# Altium project wlpkt1.PrjPcb
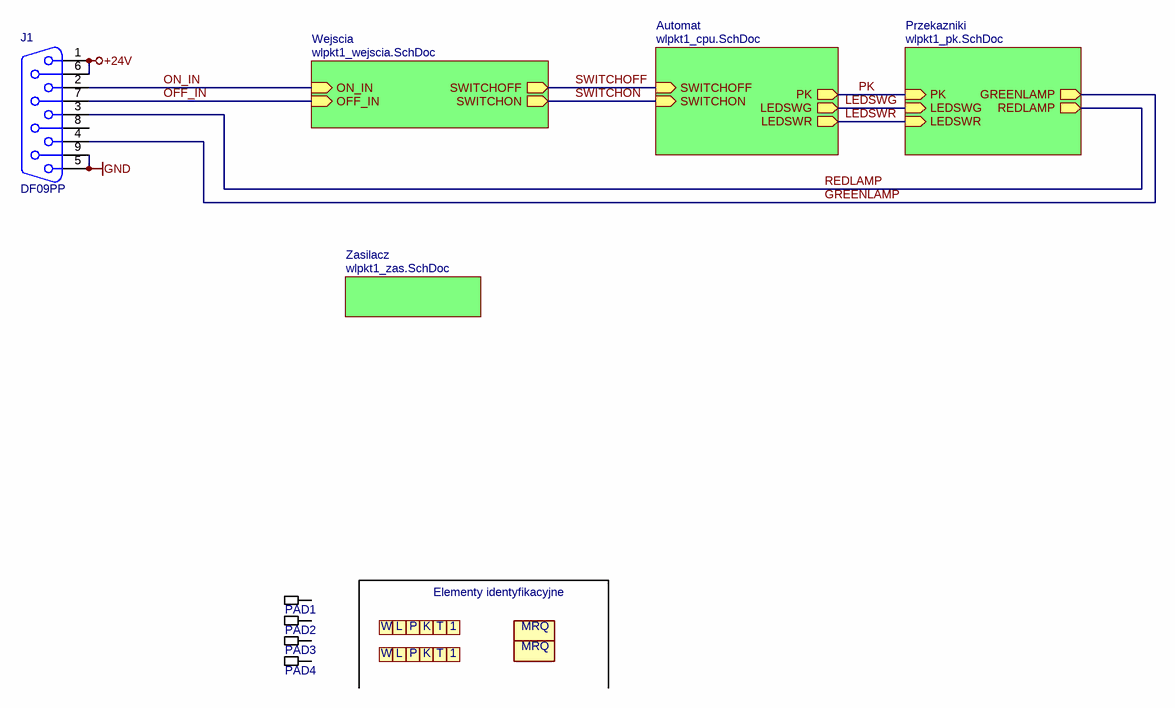
[diagram p0: wlpkt1_main.SchDoc]
Projektowal: M. Lach; NazwaModuluSkrot: WLPKT1
5 sheets, 150 parts. Net scope: hierarchical (ports join the sheet entries above them; power ports are global).
Board file: wlpkt1.PcbDoc
Sheets:
  wlpkt1_main.SchDoc
    Wejscia = wlpkt1_wejscia.SchDoc
    Automat = wlpkt1_cpu.SchDoc
    Zasilacz = wlpkt1_zas.SchDoc
    Przekazniki = wlpkt1_pk.SchDoc

## Sheet wlpkt1_main.SchDoc: Schemat główny
size A4; DocumentNumber: 1; SheetNumber: 1; SheetTotal: 5; LotOfPieces: 1

### Parts
J1  DF09PP  [DB9/F]
LETTER1  LETTERC_W  [LETTERC_W_60_10]  (value not drawn)  (no BOM)
LETTER2  LETTERC_L  [LETTERC_L_60_10]  (value not drawn)  (no BOM)
LETTER3  LETTERC_P  [LETTERC_P_60_10]  (value not drawn)  (no BOM)
LETTER4  LETTERC_K  [LETTERC_K_60_10]  (value not drawn)  (no BOM)
LETTER5  LETTERC_T  [LETTERC_T_60_10]  (value not drawn)  (no BOM)
LETTER6  LETTER_1_60_10  [LETTER_1_60_10]  (value not drawn)  (no BOM)
LETTER7  LETTERC_W  [LETTERC_W_60_10]  (value not drawn)  (no BOM)
LETTER8  LETTERC_L  [LETTERC_L_60_10]  (value not drawn)  (no BOM)
LETTER9  LETTERC_P  [LETTERC_P_60_10]  (value not drawn)  (no BOM)
LETTER10  LETTERC_K  [LETTERC_K_60_10]  (value not drawn)  (no BOM)
LETTER11  LETTERC_T  [LETTERC_T_60_10]  (value not drawn)  (no BOM)
LETTER12  LETTER_1_60_10  [LETTER_1_60_10]  (value not drawn)  (no BOM)
LOGO1  MRQ_2_8  [MRQ_2_8]  (value not drawn)  (no BOM)
LOGO2  MRQ_2_8  [MRQ_2_8]  (value not drawn)  (no BOM)
PAD1  PAD3_5MM  [PAD3_5MM]  (value not drawn)  (no BOM)
PAD2  PAD3_5MM  [PAD3_5MM]  (value not drawn)  (no BOM)
PAD3  PAD3_5MM  [PAD3_5MM]  (value not drawn)  (no BOM)
PAD4  PAD3_5MM  [PAD3_5MM]  (value not drawn)  (no BOM)

### Sub-sheets
Automat = wlpkt1_cpu.SchDoc: SWITCHOFF (in), SWITCHON (in), PK (out), LEDSWG (out), LEDSWR (out)
Przekazniki = wlpkt1_pk.SchDoc: PK (in), LEDSWG (in), LEDSWR (in), GREENLAMP (out), REDLAMP (out)
Wejscia = wlpkt1_wejscia.SchDoc: ON_IN (in), SWITCHOFF (out), SWITCHON (out), OFF_IN (in)
Zasilacz = wlpkt1_zas.SchDoc: no entries

### Nets
+24V: J1.1 J1.6
GND: J1.5 J1.9
GREENLAMP: J1.4 ; sheet Przekazniki/GREENLAMP
LEDSWG: sheet Automat/LEDSWG, sheet Przekazniki/LEDSWG
LEDSWR: sheet Automat/LEDSWR, sheet Przekazniki/LEDSWR
OFF_IN: J1.7 ; sheet Wejscia/OFF_IN
ON_IN: J1.2 ; sheet Wejscia/ON_IN
PK: sheet Automat/PK, sheet Przekazniki/PK
REDLAMP: J1.3 ; sheet Przekazniki/REDLAMP
SWITCHOFF: sheet Wejscia/SWITCHOFF, sheet Automat/SWITCHOFF
SWITCHON: sheet Wejscia/SWITCHON, sheet Automat/SWITCHON

Not connected (* = marked no-connect by the designer): J1 8; PAD1 1; PAD2 1; PAD3 1; PAD4 1

### Notes on the sheet
- Elementy identyfikacyjne
- Jeżeli nie wskazano inaczej, tolerancja rezystorów wynosi 1%
- Nazwa modułu (skrót)
- Słowna nazwa modułu
- Rozmiar arkusza
- A4
- Projektował
- Rysował
- Podpis
- Data:
- Ark.
- z
- Wer.
- (in symbol NOB5) MRQ
- (in symbol NOB7) 1
- (in symbol NOB34) W
- (in symbol NOB35) L
- (in symbol NOB36) P
- (in symbol NOB37) K
- (in symbol NOB38) T

### Library data of the parts
J1 = Con312: Kod: Con312; ID: 312; Descript: Gniazdo; D-Sub; PIN:9; żeńskie; proste; THT; złocony; Typ5: DS1034-09FUNSISS; Replacement: bd; Value: DF09PP; Price5: 2; DateOfPrice5: 2020-11-08; Supplier5: tme.pl; Reference5: DF09PP; Manufacturer5: Connfly
LETTER1 LETTER7 = NOB34: Kod: NOB34; ID: 34; Descript: bd; Value: LETTERC_W
LETTER2 LETTER8 = NOB35: Kod: NOB35; ID: 35; Descript: bd; Value: LETTERC_L
LETTER3 LETTER9 = NOB36: Kod: NOB36; ID: 36; Descript: bd; Value: LETTERC_P
LETTER4 LETTER10 = NOB37: Kod: NOB37; ID: 37; Descript: bd; Value: LETTERC_K
LETTER5 LETTER11 = NOB38: Kod: NOB38; ID: 38; Descript: bd; Value: LETTERC_T
LETTER6 LETTER12 = NOB7: Kod: NOB7; ID: 7; Descript: bd; Value: LETTER_1_60_10
LOGO1 LOGO2 = NOB5: Kod: NOB5; ID: 5; Descript: bd; Value: MRQ_2_8
PAD1-PAD4 = Oth106: PartIdx: Oth106; Identyfikator: 106; Descript: bd; Value: PAD3_5MM; DateOfPrice5: 01-01-2010; ID: 106; Manufacturer5: bd; Price5: -1; Reference5: bd; Supplier5: bd; Typ5: bd

## Sheet wlpkt1_wejscia.SchDoc: Odkłócenie wejść
size A4; DocumentNumber: 2; SheetNumber: 2; SheetTotal: 5; Subtitle0: Odkłócenie przycisków; LotOfPieces: 1
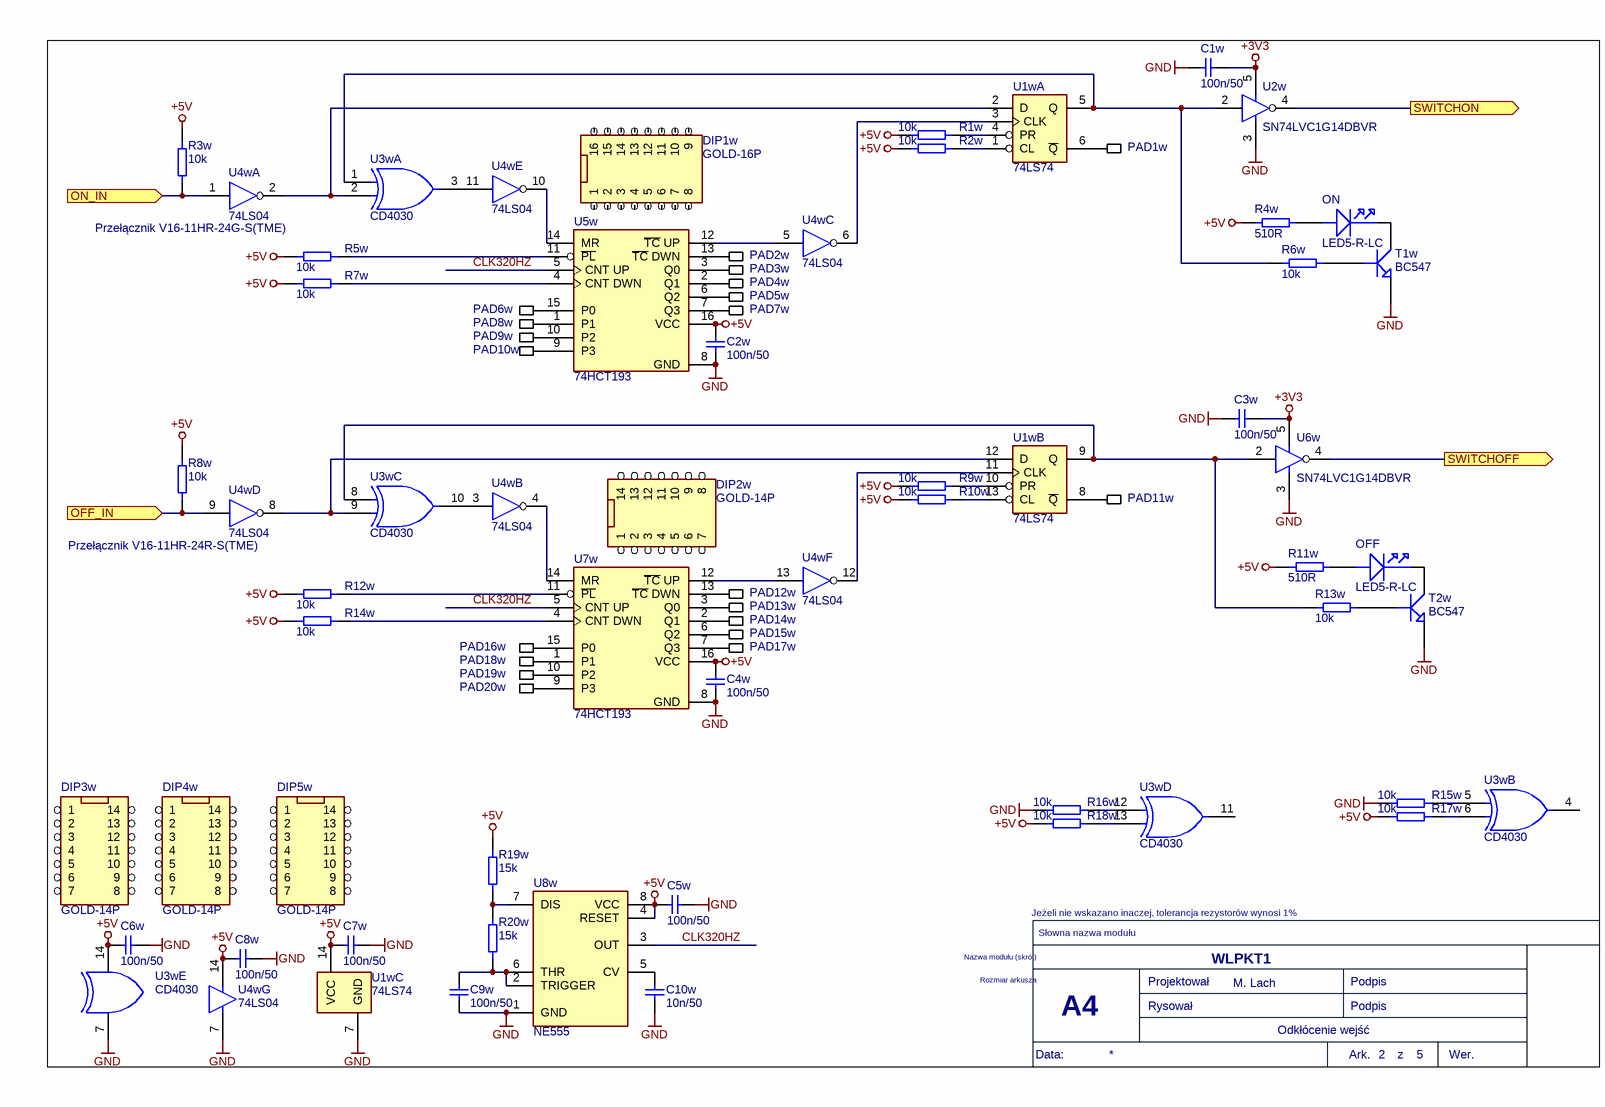
[diagram p1: wlpkt1_wejscia.SchDoc]

### Parts
C1w  100n/50  [0805]
C2w  100n/50  [0805]
C3w  100n/50  [0805]
C4w  100n/50  [0805]
C5w  100n/50  [0805]
C6w  100n/50  [0805]
C7w  100n/50  [0805]
C8w  100n/50  [0805]
C9w  100n/50  [0805]
C10w  10n/50  [0805]
DIP1w  GOLD-16P  (mechanical)
DIP2w  GOLD-14P  (mechanical)
DIP3w  GOLD-14P  (mechanical)
DIP4w  GOLD-14P  (mechanical)
DIP5w  GOLD-14P  (mechanical)
OFF  LED5-R-LC  [CO26]
ON  LED5-R-LC  [CO26]
PAD1w  PAD0_6MM  [PAD0_6MM]  (value not drawn)  (no BOM)
PAD2w  PAD0_6MM  [PAD0_6MM]  (value not drawn)  (no BOM)
PAD3w  PAD0_6MM  [PAD0_6MM]  (value not drawn)  (no BOM)
PAD4w  PAD0_6MM  [PAD0_6MM]  (value not drawn)  (no BOM)
PAD5w  PAD0_6MM  [PAD0_6MM]  (value not drawn)  (no BOM)
PAD6w  PAD0_6MM  [PAD0_6MM]  (value not drawn)  (no BOM)
PAD7w  PAD0_6MM  [PAD0_6MM]  (value not drawn)  (no BOM)
PAD8w  PAD0_6MM  [PAD0_6MM]  (value not drawn)  (no BOM)
PAD9w  PAD0_6MM  [PAD0_6MM]  (value not drawn)  (no BOM)
PAD10w  PAD0_6MM  [PAD0_6MM]  (value not drawn)  (no BOM)
PAD11w  PAD0_6MM  [PAD0_6MM]  (value not drawn)  (no BOM)
PAD12w  PAD0_6MM  [PAD0_6MM]  (value not drawn)  (no BOM)
PAD13w  PAD0_6MM  [PAD0_6MM]  (value not drawn)  (no BOM)
PAD14w  PAD0_6MM  [PAD0_6MM]  (value not drawn)  (no BOM)
PAD15w  PAD0_6MM  [PAD0_6MM]  (value not drawn)  (no BOM)
PAD16w  PAD0_6MM  [PAD0_6MM]  (value not drawn)  (no BOM)
PAD17w  PAD0_6MM  [PAD0_6MM]  (value not drawn)  (no BOM)
PAD18w  PAD0_6MM  [PAD0_6MM]  (value not drawn)  (no BOM)
PAD19w  PAD0_6MM  [PAD0_6MM]  (value not drawn)  (no BOM)
PAD20w  PAD0_6MM  [PAD0_6MM]  (value not drawn)  (no BOM)
R1w  10k  [0805R]
R2w  10k  [0805R]
R3w  10k  [0805R]
R4w  510R  [R402510]
R5w  10k  [0805R]
R6w  10k  [0805R]
R7w  10k  [0805R]
R8w  10k  [0805R]
R9w  10k  [0805R]
R10w  10k  [0805R]
R11w  510R  [R402510]
R12w  10k  [0805R]
R13w  10k  [0805R]
R14w  10k  [0805R]
R15w  10k  [0805R]
R16w  10k  [0805R]
R17w  10k  [0805R]
R18w  10k  [0805R]
R19w  15k  [0805R]
R20w  15k  [0805R]
T1w  BC547  [CE35V4]
T2w  BC547  [CE35V4]
U1w  74LS74  [14DIP300]  (parts A,B,C of 3)
U2w  SN74LVC1G14DBVR  [SOT23-5]
U3w  CD4030  [14DIP300]  (parts A,B,C,D,E of 5)
U4w  74LS04  [14DIP300]  (parts A,B,C,D,E,F,G of 7)
U5w  74HCT193  [16DIP300]
U6w  SN74LVC1G14DBVR  [SOT23-5]
U7w  74HCT193  [16DIP300]
U8w  NE555  [8DIP300]

### Ports
OFF_IN (in), ON_IN (in), SWITCHOFF (out), SWITCHON (out)

### Nets
+3V3: C1w.1 C3w.1 U2w.5(VCC) U6w.5(VCC)
+5V: C2w.1 C4w.1 C5w.1 C6w.1 C7w.1 C8w.1 R1w.1 R2w.1 R3w.1 R4w.1 R5w.1 R7w.1 R8w.1 R9w.1 R10w.1 R11w.1 R12w.1 R14w.1 R17w.1 R18w.1 R19w.1 U1w.14(VCC) U3w.14(VCC) U4w.14(VCC) U5w.16(VCC) U7w.16(VCC) U8w.4(RESET) U8w.8(VCC)
GND: C1w.2 C2w.2 C3w.2 C4w.2 C5w.2 C6w.2 C7w.2 C8w.2 C9w.2 C10w.2 R15w.1 R16w.1 T1w.EMIT T2w.EMIT U1w.7(GND) U2w.3(GND) U3w.7(GND) U4w.7(GND) U5w.8(GND) U6w.3(GND) U7w.8(GND) U8w.1(GND)
CLK320HZ: U5w.5(CNT_UP) U7w.5(CNT_UP) U8w.3(OUT)
OFF_IN: R8w.2 U4w.9(I) ; port OFF_IN
ON_IN: R3w.2 U4w.1(I) ; port ON_IN
SWITCHOFF: U6w.4(O) ; port SWITCHOFF
SWITCHON: U2w.4(O) ; port SWITCHON
NetC9w_1: C9w.1 R20w.2 U8w.2(TRIGGER) U8w.6(THR)
NetC10w_1: C10w.1 U8w.5(CV)
NetOFF_ANOD: OFF.ANOD R11w.2
NetOFF_CATH: OFF.CATH T2w.COLL
NetON_ANOD: ON.ANOD R4w.2
NetON_CATH: ON.CATH T1w.COLL
NetPAD1w_1: PAD1w.1 U1w.6(~{Q})
NetPAD2w_1: PAD2w.1 U5w.13(~{TC}_DWN)
NetPAD3w_1: PAD3w.1 U5w.3(Q0)
NetPAD4w_1: PAD4w.1 U5w.2(Q1)
NetPAD5w_1: PAD5w.1 U5w.6(Q2)
NetPAD6w_1: PAD6w.1 U5w.15(P0)
NetPAD7w_1: PAD7w.1 U5w.7(Q3)
NetPAD8w_1: PAD8w.1 U5w.1(P1)
NetPAD9w_1: PAD9w.1 U5w.10(P2)
NetPAD10w_1: PAD10w.1 U5w.9(P3)
NetPAD11w_1: PAD11w.1 U1w.8(~{Q})
NetPAD12w_1: PAD12w.1 U7w.13(~{TC}_DWN)
NetPAD13w_1: PAD13w.1 U7w.3(Q0)
NetPAD14w_1: PAD14w.1 U7w.2(Q1)
NetPAD15w_1: PAD15w.1 U7w.6(Q2)
NetPAD16w_1: PAD16w.1 U7w.15(P0)
NetPAD17w_1: PAD17w.1 U7w.7(Q3)
NetPAD18w_1: PAD18w.1 U7w.1(P1)
NetPAD19w_1: PAD19w.1 U7w.10(P2)
NetPAD20w_1: PAD20w.1 U7w.9(P3)
NetR1w_2: R1w.2 U1w.4(PR)
NetR2w_2: R2w.2 U1w.1(CL)
NetR5w_2: R5w.2 U5w.11(~{PL})
NetR6w_1: R6w.1 T1w.BASE
NetR6w_2: R6w.2 U1w.5(Q) U2w.2(I) U3w.1(I0)
NetR7w_2: R7w.2 U5w.4(CNT_DWN)
NetR9w_2: R9w.2 U1w.10(PR)
NetR10w_2: R10w.2 U1w.13(CL)
NetR12w_2: R12w.2 U7w.11(~{PL})
NetR13w_1: R13w.1 T2w.BASE
NetR13w_2: R13w.2 U1w.9(Q) U3w.8(I0) U6w.2(I)
NetR14w_2: R14w.2 U7w.4(CNT_DWN)
NetR15w_2: R15w.2 U3w.5(I0)
NetR16w_2: R16w.2 U3w.12(I0)
NetR17w_2: R17w.2 U3w.6(I1)
NetR18w_2: R18w.2 U3w.13(I1)
NetR19w_2: R19w.2 R20w.1 U8w.7(DIS)
NetU1w_2: U1w.2(D) U3w.2(I1) U4w.2(O)
NetU1w_3: U1w.3(CLK) U4w.6(O)
NetU1w_11: U1w.11(CLK) U4w.12(O)
NetU1w_12: U1w.12(D) U3w.9(I1) U4w.8(O)
NetU3w_3: U3w.3(O) U4w.11(I)
NetU3w_10: U3w.10(O) U4w.3(I)
NetU4w_4: U4w.4(O) U7w.14(MR)
NetU4w_5: U4w.5(I) U5w.12(~{TC}_UP)
NetU4w_10: U4w.10(O) U5w.14(MR)
NetU4w_13: U4w.13(I) U7w.12(~{TC}_UP)

Not connected (* = marked no-connect by the designer): DIP1w 1 2 3 4 5 6 7 8 9 10 11 12 13 14 15 16; DIP2w 1 2 3 4 5 6 7 8 9 10 11 12 13 14; DIP3w 1 2 3 4 5 6 7 8 9 10 11 12 13 14; DIP4w 1 2 3 4 5 6 7 8 9 10 11 12 13 14; DIP5w 1 2 3 4 5 6 7 8 9 10 11 12 13 14; U3w 4(O) 11(O)

### Notes on the sheet
- Przełącznik V16-11HR-24G-S(TME)
- Przełącznik V16-11HR-24R-S(TME)
- Jeżeli nie wskazano inaczej, tolerancja rezystorów wynosi 1%
- Nazwa modułu (skrót)
- Słowna nazwa modułu
- Rozmiar arkusza
- A4
- Projektował
- Rysował
- Podpis
- Data:
- Ark.
- z
- Wer.

### Library data of the parts
C1w C2w C3w C4w C5w C6w C7w C8w C9w = CAP7: Kod: CAP7; ID: 7; Descript: Kondensator: ceramiczny; MLCC; 100nF; 50V; X7R; ±10%; SMD; 0805; Reference5: CL21B104KBCNNNC; Value: 100n/50; Price5: 0; DateOfPrice5: 2010-01-01; Supplier5: tme.pl; Manufacturer5: Samsung; Typ5: CL21B104KBCNNNC
C10w = CAP21: Kod: CAP21; ID: 21; Descript: Kondensator: ceramiczny; MLCC; 10nF; 50V; X7R; ±10%; SMD; 0805; Reference5: CL21B103KBANNNC; Value: 10n/50; Price5: 0; DateOfPrice5: 2010-01-01; Supplier5: tme.pl; Manufacturer5: Samsung; Typ5: CL21B103KBANNNC
DIP1w = Con206: Kod: Con206; ID: 206; Descript: Podstawka: DIP; PIN: 16; Raster: 2,54mm; precyzyjna; THT; złocony; Typ5: DS1001-01-16BT1NSF6S; Replacement: bd; Value: GOLD-16P; Price5: 2; DateOfPrice5: 2010-01-01; Supplier5: tme; Reference5: GOLD-16P; Manufacturer5: Connfly
DIP2w DIP3w DIP4w DIP5w = Con45: Kod: Con45; ID: 45; Descript: Podstawka: DIP; PIN:14; 7,62mm; złocony; poliester; UL94V-0; 1A; Replacement: bd; Value: GOLD-14P; Price5: 2; DateOfPrice5: 2010-01-01; Supplier5: tme.pl; Reference5: GOLD-14P; Manufacturer5: Ninigi; Typ5: GOLD-14P
OFF ON = Opt27: Kod: Opt27; ID: 27; Descript: LED; 5mm; czerwony; 20mcd; 30°; Czoło: wypukłe; Raster:2,54mm; Reference5: OSNR5134A; Value: LED5-R-LC; Price5: 0; DateOfPrice5: 2010-01-01; Supplier5: tme.pl; Manufacturer5: OptoSupply; Typ5: OSNR5134A
PAD1w PAD2w PAD3w PAD4w PAD5w PAD6w PAD7w PAD8w PAD9w PAD10w PAD11w PAD12w PAD13w PAD14w PAD15w PAD16w PAD17w PAD18w PAD19w PAD20w = NOB4: Kod: NOB4; ID: 4; Descript: bd; Value: PAD0_6MM
R1w R2w R3w R5w R6w R7w R8w R9w R10w R12w R13w R14w R15w R16w R17w R18w = Res16: Kod: Res16; ID: 16; Descript: Rezystor: thick film; SMD; 0805; 10kom; 0,125W; ±1%; -55÷125°C; Reference5: SMD0805-10K-1%; Typ5: 0805S8F1002T5E; Value: 10k; Price5: 0,1; DateOfPrice5: 2020-06-25; Supplier5: tme.pl; Manufacturer5: Royal Ohm
R4w R11w = Res187: Kod: Res187; ID: 187; Descript: Rezystor: metal film; THT; 510Ω; 0,6W; ±1%; Ø2,5x6,8mm; 50ppm/°C; Reference5: M0.6W-510R; Typ5: MF006FF5100A50; Value: 510R; Price5: 0,1; DateOfPrice5: 2020-06-25; Supplier5: tme.pl; Manufacturer5: Royal Ohm
R19w R20w = Res40: Kod: Res40; ID: 40; Descript: Rezystor: thick film; SMD; 0805; 15kΩ; 0,125W; ±1%; -55÷125°C; Reference5: SMD0805-15K-1%; Typ5: 0805WAF 15K T5E; Value: 15k; Price5: 0,1; DateOfPrice5: 2020-06-25; Supplier5: tme.pl; Manufacturer5: Royal Ohm
T1w T2w = Tra9: Kod: Tra9; ID: 9; Descript: Tranzystor: NPN; bipolarny; 50V; 100mA; 500mW; TO92; Reference5: BC547A; Value: BC547; Price5: 0,1; DateOfPrice5: 2010-01-01; Supplier5: tme.pl; Manufacturer5: Diotec; Typ5: BC547A
U1w = ICs61: Kod: ICs61; ID: 61; Descript: 74LS74N IC: cyfrowy; przerzutnik D; Kanały: 2; 74LS; THT; DIP14; Value: 74LS74; Price5: 1; DateOfPrice5: 2020-12-27; Supplier5: mlach; Reference5: -; Manufacturer5: -; Typ5: -
U2w U6w = ICs245: Kod: ICs245; ID: 245; Descript: IC: cyfrowy; przerzutnik Schmitta; NOT; Kanały:1; Wejścia:1; SOT23-5; Value: SN74LVC1G14DBVR; Price5: 0; DateOfPrice5: 2010-01-01; Supplier5: tme.pl; Reference5: SN74LVC1G14DBVR; Manufacturer5: Texas Instruments; Typ5: SN74LVC1G14DBVR
U3w = ICs80: Kod: ICs80; ID: 80; Descript: CD4030BE IC: cyfrowy; XOR; CMOS; THT; DIP14; Value: CD4030; Price5: 1; DateOfPrice5: 2020-12-27; Supplier5: mlach; Reference5: -; Manufacturer5: -; Typ5: -
U4w = ICs84: Kod: ICs84; ID: 84; Descript: 74LS04N IC: cyfrowy; HEX,inwerter; Kanały: 6; THT; DIP14; Seria: 74LS; Value: 74LS04; Price5: 1; DateOfPrice5: 2020-12-27; Supplier5: mlach; Reference5: -; Manufacturer5: -; Typ5: -
U5w U7w = ICs85: Kod: ICs85; ID: 85; Descript: IC: cyfrowy; 4bit,licznik binarny w górę/w dół; Value: 74HCT193; Price5: 1; DateOfPrice5: 2020-12-27; Supplier5: mlach; Reference5: -; Manufacturer5: -; Typ5: -
U8w = ICs121: Kod: ICs121; ID: 121; Descript: Układ peryferyjny; astabilny,monostabilny,zegar RC; 10 V; DIP8; Reference5: NE555P; Value: NE555; Price5: 1,5; DateOfPrice5: 2020-11-14; Supplier5: tme.pl; Manufacturer5: TI; Typ5: NE555P

## Sheet wlpkt1_cpu.SchDoc: Moduł mikrokontrolera
size A4; DocumentNumber: 3; SheetNumber: 3; SheetTotal: 5
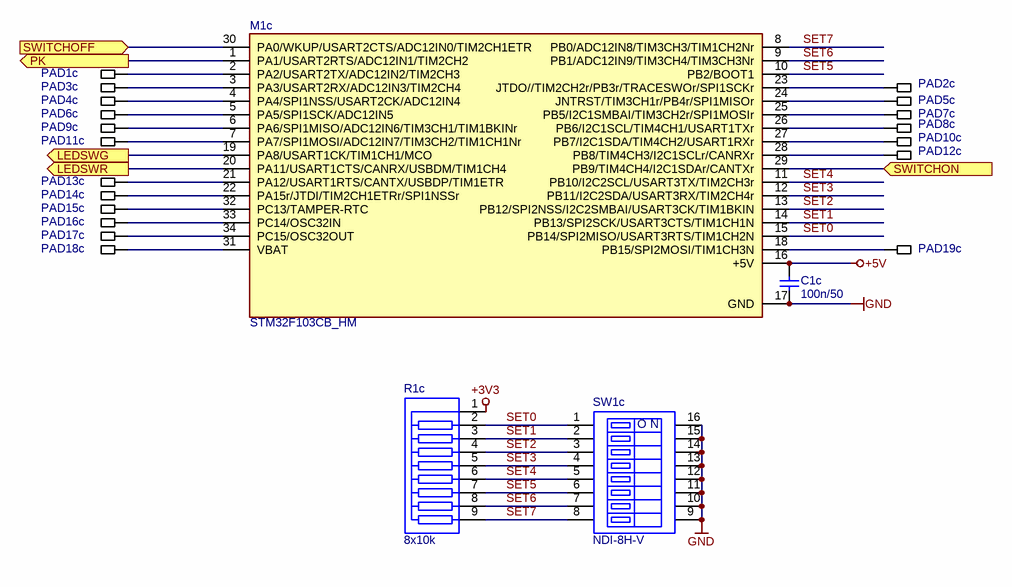
[diagram p2: wlpkt1_cpu.SchDoc]

### Parts
C1c  100n/50  [0805]
M1c  STM32F103CB_HM  [STM32F103CB_HM]
PAD1c  PAD0_6MM  [PAD0_6MM]  (value not drawn)  (no BOM)
PAD2c  PAD0_6MM  [PAD0_6MM]  (value not drawn)  (no BOM)
PAD3c  PAD0_6MM  [PAD0_6MM]  (value not drawn)  (no BOM)
PAD4c  PAD0_6MM  [PAD0_6MM]  (value not drawn)  (no BOM)
PAD5c  PAD0_6MM  [PAD0_6MM]  (value not drawn)  (no BOM)
PAD6c  PAD0_6MM  [PAD0_6MM]  (value not drawn)  (no BOM)
PAD7c  PAD0_6MM  [PAD0_6MM]  (value not drawn)  (no BOM)
PAD8c  PAD0_6MM  [PAD0_6MM]  (value not drawn)  (no BOM)
PAD9c  PAD0_6MM  [PAD0_6MM]  (value not drawn)  (no BOM)
PAD10c  PAD0_6MM  [PAD0_6MM]  (value not drawn)  (no BOM)
PAD11c  PAD0_6MM  [PAD0_6MM]  (value not drawn)  (no BOM)
PAD12c  PAD0_6MM  [PAD0_6MM]  (value not drawn)  (no BOM)
PAD13c  PAD0_6MM  [PAD0_6MM]  (value not drawn)  (no BOM)
PAD14c  PAD0_6MM  [PAD0_6MM]  (value not drawn)  (no BOM)
PAD15c  PAD0_6MM  [PAD0_6MM]  (value not drawn)  (no BOM)
PAD16c  PAD0_6MM  [PAD0_6MM]  (value not drawn)  (no BOM)
PAD17c  PAD0_6MM  [PAD0_6MM]  (value not drawn)  (no BOM)
PAD18c  PAD0_6MM  [PAD0_6MM]  (value not drawn)  (no BOM)
PAD19c  PAD0_6MM  [PAD0_6MM]  (value not drawn)  (no BOM)
R1c  8x10k  [9SIP100]
SW1c  NDI-8H-V  [EAH108E]

### Ports
LEDSWG (out), LEDSWR (out), PK (out), SWITCHOFF (in), SWITCHON (in)

### Nets
+3V3: R1c.1
+5V: C1c.1 M1c.16(+5V)
GND: C1c.2 M1c.17(GND) SW1c.9 SW1c.10 SW1c.11 SW1c.12 SW1c.13 SW1c.14 SW1c.15 SW1c.16
LEDSWG: M1c.19(PA8/USART1CK/TIM1CH1/MCO) ; port LEDSWG
LEDSWR: M1c.20(PA11/USART1CTS/CANRX/USBDM/TIM1CH4) ; port LEDSWR
PK: M1c.1(PA1/USART2RTS/ADC12IN1/TIM2CH2) ; port PK
SET0: M1c.15(PB14/SPI2MISO/USART3RTS/TIM1CH2N) R1c.2(R8) SW1c.1
SET1: M1c.14(PB13/SPI2SCK/USART3CTS/TIM1CH1N) R1c.3(R7) SW1c.2
SET2: M1c.13(PB12/SPI2NSS/I2C2SMBAI/USART3CK/TIM1BKIN) R1c.4(R6) SW1c.3
SET3: M1c.12(PB11/I2C2SDA/USART3RX/TIM2CH4r) R1c.5(R5) SW1c.4
SET4: M1c.11(PB10/I2C2SCL/USART3TX/TIM2CH3r) R1c.6(R4) SW1c.5
SET5: M1c.10(PB2/BOOT1) R1c.7(R3) SW1c.6
SET6: M1c.9(PB1/ADC12IN9/TIM3CH4/TIM3CH3Nr) R1c.8(R2) SW1c.7
SET7: M1c.8(PB0/ADC12IN8/TIM3CH3/TIM1CH2Nr) R1c.9(R1) SW1c.8
SWITCHOFF: M1c.30(PA0/WKUP/USART2CTS/ADC12IN0/TIM2CH1ETR) ; port SWITCHOFF
SWITCHON: M1c.29(PB9/TIM4CH4/I2C1SDAr/CANTXr) ; port SWITCHON
NetM1c_2: M1c.2(PA2/USART2TX/ADC12IN2/TIM2CH3) PAD1c.1
NetM1c_3: M1c.3(PA3/USART2RX/ADC12IN3/TIM2CH4) PAD3c.1
NetM1c_4: M1c.4(PA4/SPI1NSS/USART2CK/ADC12IN4) PAD4c.1
NetM1c_5: M1c.5(PA5/SPI1SCK/ADC12IN5) PAD6c.1
NetM1c_6: M1c.6(PA6/SPI1MISO/ADC12IN6/TIM3CH1/TIM1BKINr) PAD9c.1
NetM1c_7: M1c.7(PA7/SPI1MOSI/ADC12IN7/TIM3CH2/TIM1CH1Nr) PAD11c.1
NetM1c_18: M1c.18(PB15/SPI2MOSI/TIM1CH3N) PAD19c.1
NetM1c_21: M1c.21(PA12/USART1RTS/CANTX/USBDP/TIM1ETR) PAD13c.1
NetM1c_22: M1c.22(PA15r/JTDI/TIM2CH1ETRr/SPI1NSSr) PAD14c.1
NetM1c_23: M1c.23(JTDO//TIM2CH2r/PB3r/TRACESWOr/SPI1SCKr) PAD2c.1
NetM1c_24: M1c.24(JNTRST/TIM3CH1r/PB4r/SPI1MISOr) PAD5c.1
NetM1c_25: M1c.25(PB5/I2C1SMBAI/TIM3CH2r/SPI1MOSIr) PAD7c.1
NetM1c_26: M1c.26(PB6/I2C1SCL/TIM4CH1/USART1TXr) PAD8c.1
NetM1c_27: M1c.27(PB7/I2C1SDA/TIM4CH2/USART1RXr) PAD10c.1
NetM1c_28: M1c.28(PB8/TIM4CH3/I2C1SCLr/CANRXr) PAD12c.1
NetM1c_31: M1c.31(VBAT) PAD18c.1
NetM1c_32: M1c.32(PC13/TAMPER-RTC) PAD15c.1
NetM1c_33: M1c.33(PC14/OSC32IN) PAD16c.1
NetM1c_34: M1c.34(PC15/OSC32OUT) PAD17c.1

### Notes on the sheet
- Jeżeli nie wskazano inaczej, tolerancja rezystorów wynosi 1%
- Nazwa modułu (skrót)
- Słowna nazwa modułu
- Rozmiar arkusza
- A4
- Projektował
- Rysował
- Podpis
- Data:
- Ark.
- z
- Wer.
- (in symbol Elm19) O N

### Library data of the parts
C1c = CAP7: as C1w on sheet wlpkt1_wejscia; Value: 100n/50; Price5: 0; DateOfPrice5: 2010-01-01; Supplier5: tme.pl; Manufacturer5: Samsung; Typ5: CL21B104KBCNNNC
M1c = Mod98: Kod: Mod98; ID: 98; Descript: Moduł STM32F103CB_HM; Value: STM32F103CB_HM; Price5: 100; DateOfPrice5: 2020-12-20; Supplier5: mlach; Reference5: STM32F103CB_HM; Manufacturer5: mlach; Typ5: STM32F103CB_HM
PAD1c PAD2c PAD3c PAD4c PAD5c PAD6c PAD7c PAD8c PAD9c PAD10c PAD11c PAD12c PAD13c PAD14c PAD15c PAD16c PAD17c PAD18c PAD19c = NOB4: Kod: NOB4; ID: 4; Descript: bd; Value: PAD0_6MM
R1c = Res285: Kod: Res285; ID: 285; Descript: Drabinka rezystorowa: X; 10kom; Il.rezystorów: 8; THT; 0,125W; ±2%; Reference5: DR10K-8/9; Typ5: bd; Value: 8x10k; Price5: 0,5; DateOfPrice5: 2020-12-28; Supplier5: tme; Manufacturer5: bd
SW1c = Elm19: Kod: Elm19; ID: 19; Descript: Przełącznik: DIP-SWITCH; Ilość sekcji:8; ON-OFF; 0,1A/24VDC; 500V; Value: NDI-8H-V; Price5: 4; DateOfPrice5: 2010-01-01; Supplier5: tme.pl; Reference5: EAH108E; Manufacturer5: Diptronics; Typ5: NDI-8H-V

## Sheet wlpkt1_zas.SchDoc: Zasilacz
size A4; DocumentNumber: 4; SheetNumber: 4; SheetTotal: 5
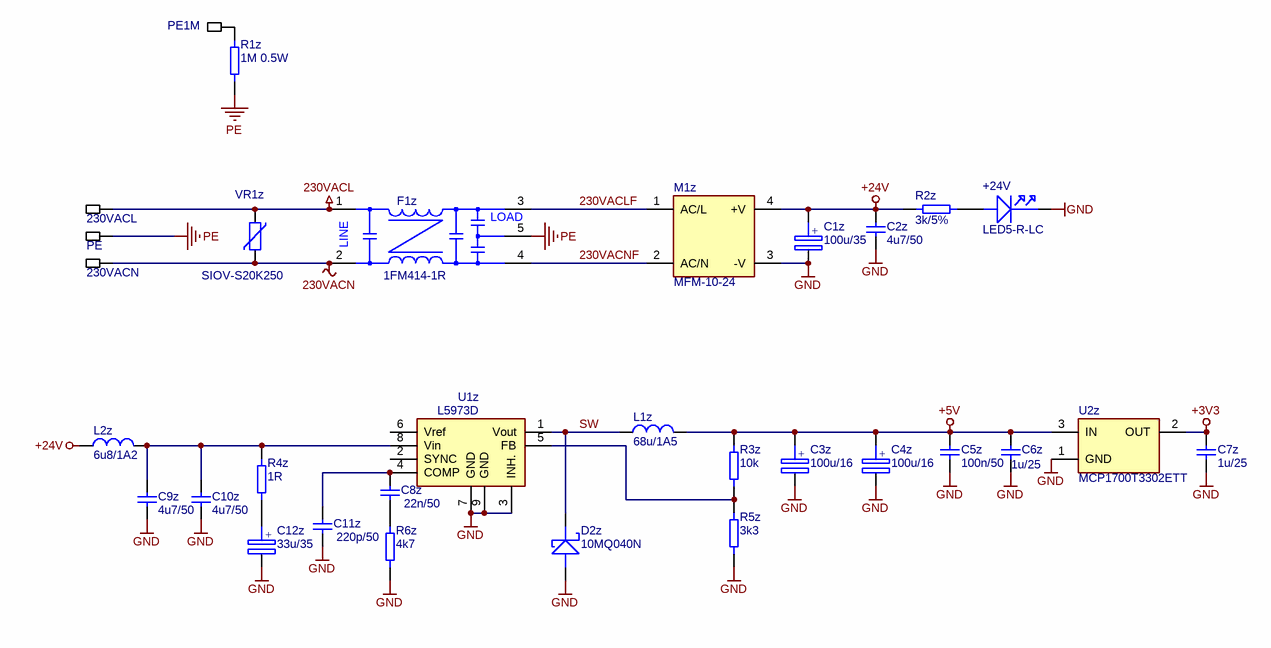
[diagram p3: wlpkt1_zas.SchDoc]

### Parts
230VACL  PAD1_5MM  [PAD1_5MM]  (value not drawn)  (no BOM)
230VACN  PAD1_5MM  [PAD1_5MM]  (value not drawn)  (no BOM)
+24V  LED5-R-LC  [CO26]
C1z  100u/35  [CE1028]
C2z  4u7/50  [1210]
C3z  100u/16  [CEL7343-43]
C4z  100u/16  [CEL7343-43]
C5z  100n/50  [0805]
C6z  1u/25  [0805]
C7z  1u/25  [0805]
C8z  22n/50  [0603-IPC]
C9z  4u7/50  [1210]
C10z  4u7/50  [1210]
C11z  220p/50  [0603-IPC]
C12z  33u/35  [CEL7343-31]
D2z  10MQ040N  [SMA]
F1z  1FM414-1R  [1FM414]
L1z  68u/1A5  [SRR1208]
L2z  6u8/1A2  [WE-PD3]
M1z  MFM-10-24  [MFM-10-24]
PE  PAD1_5MM  [PAD1_5MM]  (value not drawn)  (no BOM)
PE1M  PAD1_5MM  [PAD1_5MM]  (value not drawn)  (no BOM)
R1z  1M 0.5W  [R502816]
R2z  3k/5%  [R402510V]
R3z  10k  [0805R]
R4z  1R  [R402510]
R5z  3k3  [0805R]
R6z  4k7  [0603R]
U1z  L5973D  [HSOP8]
U2z  MCP1700T3302ETT  [SOT23-3]
VR1z  SIOV-S20K250  [SIOV-S20K275]

### Nets
230VACL: 230VACL.1 F1z.1(IN1) VR1z.1
230VACN: 230VACN.1 F1z.2(IN2) VR1z.2
+3V3: C7z.1 U2z.2(OUT)
+5V: C3z.2 C4z.2 C5z.2 C6z.1 L1z.2 R3z.1 U2z.3(IN)
+24V: C1z.2 C2z.1 L2z.1 M1z.4(+V) R2z.1
GND: +24V.CATH C1z.1 C2z.2 C3z.1 C4z.1 C5z.1 C6z.2 C7z.2 C9z.2 C10z.2 C11z.2 C12z.1 D2z.2(ANOD) M1z.3(-V) R5z.2 R6z.2 U1z.3(INH.) U1z.7(GND) U1z.9(GND) U2z.1(GND)
PE: F1z.5 PE.1 R1z.1
230VACLF: F1z.3(OUT2) M1z.1(AC/L)
230VACNF: F1z.4(OUT1) M1z.2(AC/N)
SW: D2z.1(CATH) L1z.1 U1z.1(Vout)
Net+24V_ANOD: +24V.ANOD R2z.2
NetC8z_1: C8z.1 C11z.1 U1z.4(COMP)
NetC8z_2: C8z.2 R6z.1
NetC9z_1: C9z.1 C10z.1 L2z.2 R4z.1 U1z.8(Vin)
NetC12z_2: C12z.2 R4z.2
NetPE1M_1: PE1M.1 R1z.2
NetR3z_2: R3z.2 R5z.1 U1z.5(FB)

Not connected (* = marked no-connect by the designer): U1z 2(SYNC) 6(Vref)

### Notes on the sheet
- Jeżeli nie wskazano inaczej, tolerancja rezystorów wynosi 1%
- Nazwa modułu (skrót)
- Słowna nazwa modułu
- Rozmiar arkusza
- A4
- Projektował
- Rysował
- Podpis
- Data:
- Ark.
- z
- Wer.
- (in symbol CAP13) +
- (in symbol CAP15) +
- (in symbol CAP71) +
- (in symbol Ind14) LOAD; LINE

### Library data of the parts
230VACL 230VACN PE PE1M = NOB33: Kod: NOB33; ID: 33; Descript: bd; Value: PAD1_5MM
+24V = Opt27: as OFF on sheet wlpkt1_wejscia; Value: LED5-R-LC; Price5: 0; DateOfPrice5: 2010-01-01; Supplier5: tme.pl; Manufacturer5: OptoSupply; Typ5: OSNR5134A
C1z = CAP15: PartIdx: CAP15; Descript: Kondensator: elektrolityczny; THT; 100uF; 35VDC; Ø6,3x11mm; ±20%; Reference5: SD1V107M6L011BB; Identyfikator: 15; Value: 100u/35; Supplier5: tme.pl; Manufacturer5: SAMHA; Typ5: SD1V107M6L011BB; Price5: 0; DateOfPrice5: 01-01-2010; ID: 15
C2z = CAP99: PartIdx: CAP99; Descript: Kondensator: ceramiczny; 4,7uF; 50V; X7R; ±10%; SMD; 1210; -55÷125°C; Reference5: CL32B475KBUYNNE; Identyfikator: 99; Value: 4u7/50; Supplier5: tme.pl; Manufacturer5: Samsung; Typ5: CL32B475KBUYNNE; Price5: 2; DateOfPrice5: 01-01-2010; ID: 99
C3z C4z = CAP13: Descript: Kondensator: tantalowy; low ESR; 100uF; 16VDC; Obud: E; 2917; TPS; Reference5: TPSE107M016R0100; Kod: CAP13; ID: 13; Value: 100u/16; Supplier5: tme.pl; Manufacturer5: AVX; Typ5: TPSE107M016R0100; Price5: 2; DateOfPrice5: 2010-01-01
C5z = CAP7: Descript: Kondensator: ceramiczny; MLCC; 100nF; 50V; X7R; ±10%; SMD; 0805; Reference5: CL21B104KBCNNNC; Kod: CAP7; ID: 7; Value: 100n/50; Supplier5: tme.pl; Manufacturer5: Samsung; Typ5: CL21B104KBCNNNC; Price5: 0; DateOfPrice5: 2010-01-01
C6z C7z = CAP38: Kod: CAP38; ID: 38; Descript: Kondensator: ceramiczny; MLCC; 1uF; 25V; X7R; ±10%; SMD; 0805; Reference5: CL21B105KAFNNN; Value: 1u/25; Price5: 0; DateOfPrice5: 2010-01-01; Supplier5: tme.pl; Manufacturer5: Samsung; Typ5: CL21B105KAFNNN
C8z = CAP51: Descript: Kondensator: ceramiczny; 22nF; 50V; X7R; ±10%; SMD; 0603; -55÷125°C; Reference5: CL10B223KB8NNNC; Kod: CAP51; ID: 51; Value: 22n/50; Supplier5: tme.pl; Manufacturer5: Samsung; Typ5: CL10B223KB8NNNC; Price5: 0; DateOfPrice5: 2010-01-01
C9z C10z = CAP99: Kod: CAP99; ID: 99; Descript: Kondensator: ceramiczny; 4,7uF; 50V; X7R; ±10%; SMD; 1210; -55÷125°C; Reference5: CL32B475KBUYNNE; Value: 4u7/50; Price5: 1,9; DateOfPrice5: 2020-11-08; Supplier5: tme.pl; Manufacturer5: Samsung; Typ5: CL32B475KBUYNNE
C11z = CAP45: Descript: Kondensator: ceramiczny; 220pF; 50V; X7R; ±10%; SMD; 0603; -55÷125°C; Reference5: CL10B221KB8NNNC; Kod: CAP45; ID: 45; Value: 220p/50; Supplier5: tme.pl; Manufacturer5: Samsung; Typ5: CL10B221KB8NNNC; Price5: 0; DateOfPrice5: 2010-01-01
C12z = CAP71: Descript: Kondensator: tantalowy; 33uF; 35VDC; SMD; Obud: D; 2917; ±10%; Reference5: TAJD336K035R; Kod: CAP71; ID: 71; Value: 33u/35; Supplier5: tme.pl; Manufacturer5: AVX; Typ5: TAJD336K035R; Price5: 8; DateOfPrice5: 2010-01-01
D2z = DIO1: Descript: Dioda: prostownicza Schottky; SMD; 40V; 2,1A; DO214AC; Reference5: 10MQ040NTRPBF; Typ5: VS-10MQ040NTRPBF; Kod: DIO1; ID: 1; Value: 10MQ040N; Supplier5: tme.pl; Price5: 0; DateOfPrice5: 2010-01-01; Manufacturer5: Vishay
F1z = Ind14: PartIdx: Ind14; Descript: Radio filter 250VAC, 1A; Identyfikator: 14; Value: 1FM414-1R; Reference5: 1FM414-1R; Supplier5: tme.pl; Manufacturer5: FilterCon; Price5: 15; DateOfPrice5: 01-01-2010; ID: 14; InductCurr: -; Typ5: -
L1z = Ind35: Descript: Power choke 68uH, 1.5A, 12x12mm; Reference5: DE1205-68; Kod: Ind35; InductCurr: 1,5A; ID: 35; Value: 68u/1A5; Supplier5: tme.pl; Manufacturer5: Ferrocore; Typ5: DE1205-68; Price5: 1; DateOfPrice5: 2010-01-01
L2z = Ind38: Kod: Ind38; ID: 38; Descript: Cewka zasilająca (SMD), 6.8 µH, 1.2 A, 500 mA, Seria WE-PD3, 6.6mm x 4.45mm x 2.92mm, Osłonięte; Reference5: 1636061; Typ5: 744 51 068; Value: 6u8/1A2; Price5: 11; DateOfPrice5: 2010-01-01; Supplier5: farnell.com; Manufacturer5: Würth Elektronik
M1z = Mod92: Kod: Mod92; ID: 92; Descript: Zasilacz: impulsowy; 10W; 80÷264VAC; Wyjścia: 1; 420mA; -30÷85°C; Value: MFM-10-24; Price5: 35; DateOfPrice5: 2010-01-01; Supplier5: tme.pl; Reference5: MFM-10-24; Manufacturer5: MeanWell; Typ5: MFM-10-24
R1z = Res69: PartIdx: Res69; Descript: Resistor 1 megaohm, 0.5W, 5%; Reference5: 1/2W-1M; Identyfikator: 69; Typ5: brak danych; Value: 1M 0.5W; Supplier5: tme.pl; Price5: 0,1; DateOfPrice5: 25-06-2020 12:16:54; Manufacturer5: brak danych; ID: 69
R2z = Res284: Kod: Res284; ID: 284; Descript: ML0.25W-3K-5% Rezystor metalizowany THT 3kom; 0,25W; ±5%;; Reference5: bd; Value: 3k/5%; Price5: 0,2; DateOfPrice5: 2020-12-27; Supplier5: mlach; Manufacturer5: bd; Typ5: bd
R3z = Res16: Descript: Rezystor: thick film; SMD; 0805; 10kom; 0,125W; ±1%; -55÷125°C; Reference5: SMD0805-10K-1%; Typ5: 0805S8F1002T5E; Kod: Res16; ID: 16; Value: 10k; Supplier5: tme.pl; Manufacturer5: Royal Ohm; Price5: 0,1; DateOfPrice5: 2020-06-25
R4z = Res72: Kod: Res72; ID: 72; Descript: Rezystor: metal film; THT; 1om; 0,6W; ±1%; Ø2,5x6,8mm; 200ppm/°C; Reference5: M0.6W-1R; Typ5: MF006FJ100KA50; Value: 1R; Price5: 0,1; DateOfPrice5: 2020-06-25; Supplier5: tme.pl; Manufacturer5: Royal Ohm
R5z = Res145: Descript: Rezystor: thick film; SMD; 0805; 3,3kΩ; 0,125W; ±1%; -55÷125°C; Reference5: SMD0805-3K3-1%; Typ5: 0805S8F3301T5E; Kod: Res145; ID: 145; Value: 3k3; Supplier5: tme.pl; Manufacturer5: Royal Ohm; Price5: 0,1; DateOfPrice5: 2020-06-25
R6z = Res171: Descript: Rezystor: thick film; SMD; 0603; 4,7kom; 0,1W; ±1%; -55÷125°C; Reference5: SMD0603-4K7-1%; Typ5: 0603SAF4701T5E; Kod: Res171; ID: 171; Value: 4k7; Supplier5: tme.pl; Manufacturer5: Royal Ohm; Price5: 0,1; DateOfPrice5: 2020-06-25
U1z = ICs119: Descript: Driver; przetwornica DC/DC; 2,5A; 1,2÷35V; 2,25W; Kanały: 1; 250kHz; Kod: ICs119; ID: 119; Value: L5973D; Supplier5: tme.pl; Reference5: L5973D; Manufacturer5: ST; Typ5: L5973D; Price5: 10; DateOfPrice5: 2010-01-01
U2z = ICs182: Kod: ICs182; ID: 182; Descript: Stabilizator napięcia; LDO, nieregulowany; 3,3V; 0,25A; SOT23-3; Typ5: MCP1700T3302E/TT; Value: MCP1700T3302ETT; Price5: 1,8; DateOfPrice5: 2020-05-10; Supplier5: tme.pl; Reference5: MCP1700T3302ETT; Manufacturer5: Microchip
VR1z = Vre35: PartIdx: Vre35; Descript: Warystor: metalowo-tlenkowy; THT; 250VAC; 320VDC; 390V; 8000A; 140J; Identyfikator: 35; Value: SIOV-S20K250; Reference5: SIOV-S20K250; Supplier5: tme.pl; Manufacturer5: Epcos; Price5: 2,6; Typ5: S20K250; DateOfPrice5: 03-06-2020; ID: 35

## Sheet wlpkt1_pk.SchDoc: Przekaźniki wykonawczy
size A4; DocumentNumber: 5; SheetNumber: 5; SheetTotal: 5
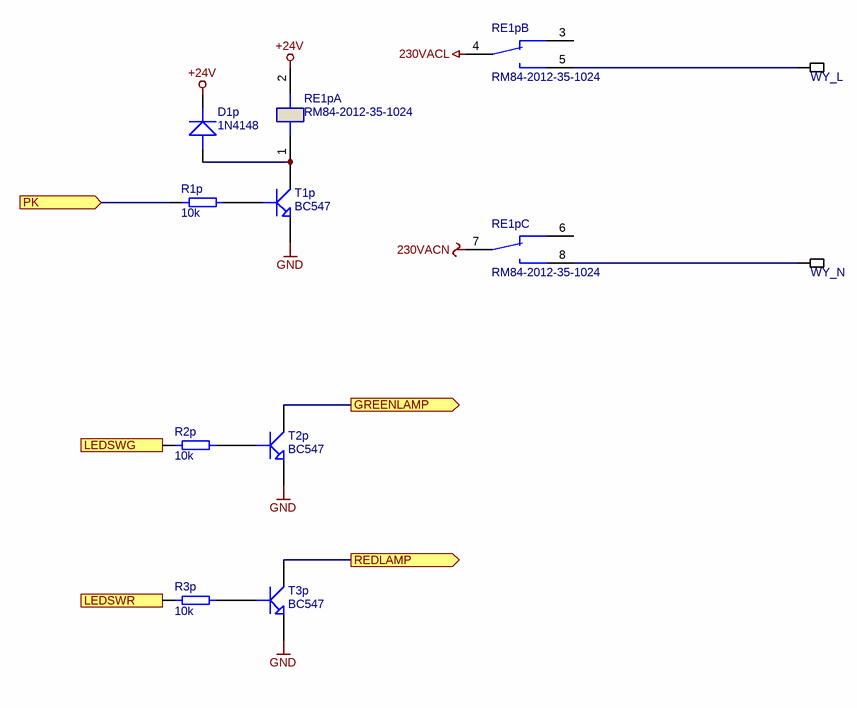
[diagram p4: wlpkt1_pk.SchDoc]

### Parts
D1p  1N4148  [CE02]
R1p  10k  [0805R]
R2p  10k  [0805R]
R3p  10k  [0805R]
RE1p  RM84-2012-35-1024  [RM84-P]  (parts A,B,C of 3)
T1p  BC547  [CE35V4]
T2p  BC547  [CE35V4]
T3p  BC547  [CE35V4]
WY_L  PAD1_5MM  [PAD1_5MM]  (value not drawn)  (no BOM)
WY_N  PAD1_5MM  [PAD1_5MM]  (value not drawn)  (no BOM)

### Ports
GREENLAMP (out), LEDSWG (in), LEDSWR (in), PK (in), REDLAMP (out)

### Nets
230VACL: RE1p.4
230VACN: RE1p.7
+24V: D1p.CATH RE1p.2(A2)
GND: T1p.EMIT T2p.EMIT T3p.EMIT
GREENLAMP: T2p.COLL ; port GREENLAMP
LEDSWG: R2p.2 ; port LEDSWG
LEDSWR: R3p.2 ; port LEDSWR
PK: R1p.2 ; port PK
REDLAMP: T3p.COLL ; port REDLAMP
NetD1p_ANOD: D1p.ANOD RE1p.1(A1) T1p.COLL
NetR1p_1: R1p.1 T1p.BASE
NetR2p_1: R2p.1 T2p.BASE
NetR3p_1: R3p.1 T3p.BASE
NetRE1p_5: RE1p.5 WY_L.1
NetRE1p_8: RE1p.8 WY_N.1

Not connected (* = marked no-connect by the designer): RE1p 3(22) 6(12)

### Notes on the sheet
- Jeżeli nie wskazano inaczej, tolerancja rezystorów wynosi 1%
- Nazwa modułu (skrót)
- Słowna nazwa modułu
- Rozmiar arkusza
- A4
- Projektował
- Rysował
- Podpis
- Data:
- Ark.
- z
- Wer.

### Library data of the parts
D1p = DIO2: Kod: DIO2; ID: 2; Descript: Dioda: przełączająca; 100V; 300mA; 2A; DO35; Typ5: 1N4148-TAP; Value: 1N4148; Price5: 0,3; DateOfPrice5: 2020-11-08; Supplier5: tme.pl; Reference5: 1N4148; Manufacturer5: Vishay
R1p R2p R3p = Res16: as R1w on sheet wlpkt1_wejscia; Value: 10k; Price5: 0,1; DateOfPrice5: 2020-06-25; Supplier5: tme.pl; Manufacturer5: Royal Ohm
RE1p = Rel14: Kod: Rel14; ID: 14; Descript: Przekaźnik: elektromagnetyczny; DPDT; Ucewki : 24VDC; 8A/250VAC; Value: RM84-2012-35-1024; Price5: 6,5; DateOfPrice5: 2010-01-01; Supplier5: tme.pl; Reference5: RM84-2012-35-1024; Manufacturer5: Relpol; Typ5: RM84-2012-35-1024
T1p T2p T3p = Tra9: as T1w on sheet wlpkt1_wejscia; Value: BC547; Price5: 0,1; DateOfPrice5: 2010-01-01; Supplier5: tme.pl; Manufacturer5: Diotec; Typ5: BC547A
WY_L WY_N = NOB33: Kod: NOB33; ID: 33; Descript: bd; Value: PAD1_5MM

## Nets that join several sheets
230VACL: wlpkt1_zas (230VACL.1 F1z.1 VR1z.1), wlpkt1_pk (RE1p.4)
230VACN: wlpkt1_zas (230VACN.1 F1z.2 VR1z.2), wlpkt1_pk (RE1p.7)
+3V3: wlpkt1_wejscia (C1w.1 C3w.1 U2w.5 U6w.5), wlpkt1_cpu (R1c.1), wlpkt1_zas (C7z.1 U2z.2)
+5V: wlpkt1_wejscia (28 pins), wlpkt1_cpu (C1c.1 M1c.16), wlpkt1_zas (7 pins)
+24V: wlpkt1_main (J1.1 J1.6), wlpkt1_zas (5 pins), wlpkt1_pk (D1p.CATH RE1p.2)
GND: wlpkt1_main (J1.5 J1.9), wlpkt1_wejscia (22 pins), wlpkt1_cpu (10 pins), wlpkt1_zas (20 pins), wlpkt1_pk (T1p.EMIT T2p.EMIT T3p.EMIT)
GREENLAMP: wlpkt1_main (J1.4), wlpkt1_pk (T2p.COLL)
LEDSWG: wlpkt1_cpu (M1c.19), wlpkt1_pk (R2p.2)
LEDSWR: wlpkt1_cpu (M1c.20), wlpkt1_pk (R3p.2)
OFF_IN: wlpkt1_main (J1.7), wlpkt1_wejscia (R8w.2 U4w.9)
ON_IN: wlpkt1_main (J1.2), wlpkt1_wejscia (R3w.2 U4w.1)
PK: wlpkt1_cpu (M1c.1), wlpkt1_pk (R1p.2)
REDLAMP: wlpkt1_main (J1.3), wlpkt1_pk (T3p.COLL)
SWITCHOFF: wlpkt1_wejscia (U6w.4), wlpkt1_cpu (M1c.30)
SWITCHON: wlpkt1_wejscia (U2w.4), wlpkt1_cpu (M1c.29)